# EAGLE design autowater (EAGLE 6.3)
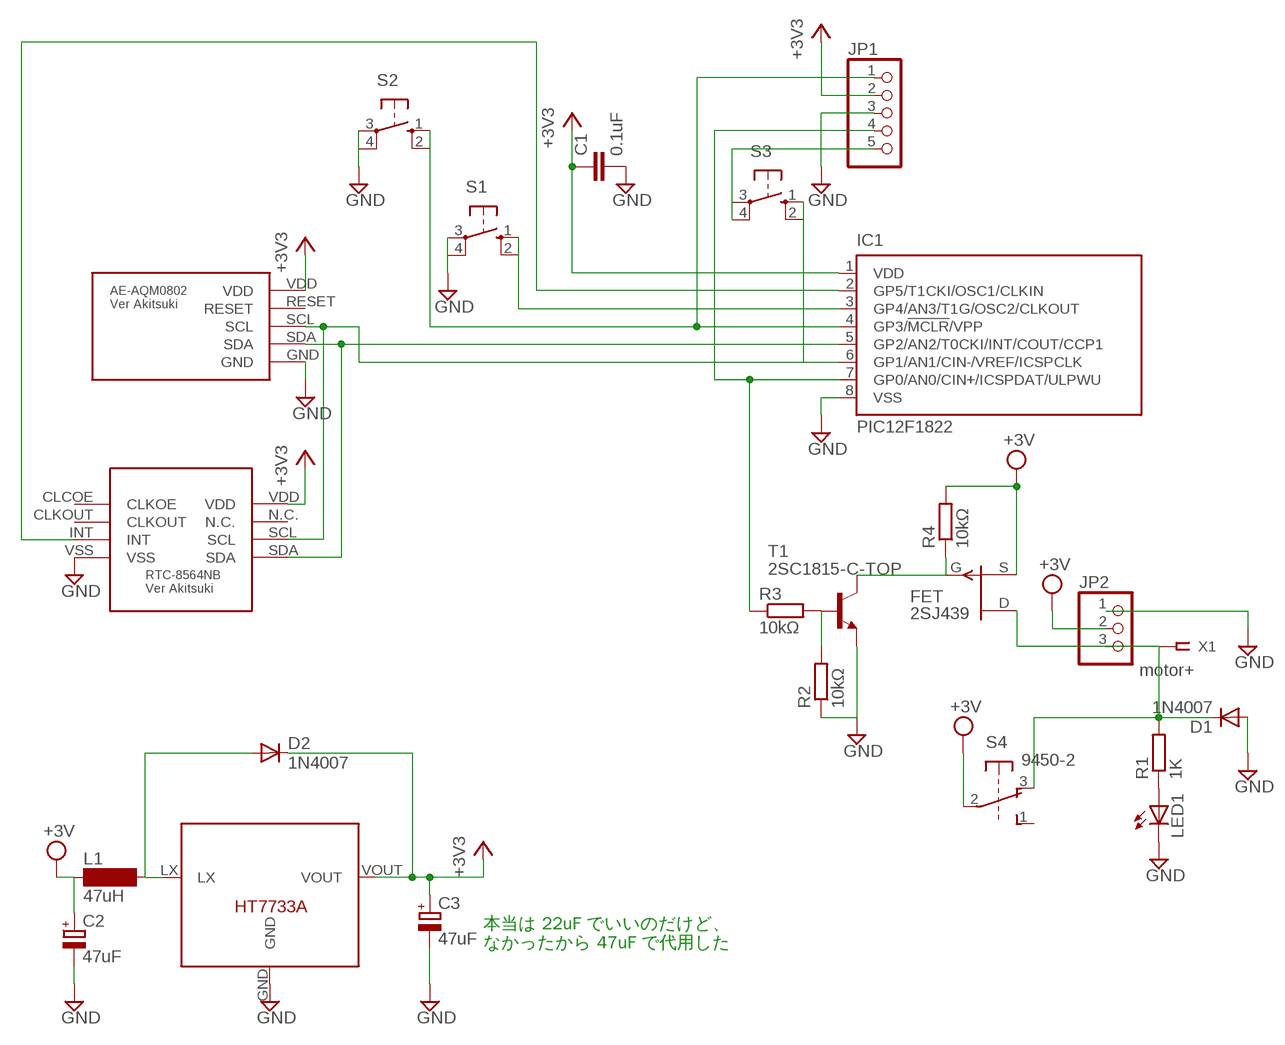
[diagram p0: schematic, sheet 1]

## Parts
C1  0.1uF  C7.5/3  [C7.5B3]
C2  47uF  CPOL-EUTT2D5  [TT2D5]
C3  47uF  CPOL-EUTT2D5  [TT2D5]
D1  1N4007  1N4148DO35-7  [DO35-7]
D2  1N4007  1N4148DO35-7  [DO35-7]
FET  2SJ439  [2SJ439]
IC1  PIC12F1822  PIC12F683P  [DIL8]
JP1  PINHD-1X5  [1X05]
JP2  PINHD-1X3  [1X03]
L1  47uH  SD75  [SD75]
LED1  LEDLZR181  [LZR181]
R1  1K  R-EU_0204/7  [0204/7]
R2  10kΩ  R-EU_0204/7  [0204/7]
R3  10kΩ  R-EU_0207/12  [0207/12]
R4  10kΩ  R-EU_0204/7  [0204/7]
S1  10-XX  [B3F-10XX]
S2  10-XX  [B3F-10XX]
S3  10-XX  [B3F-10XX]
S4  9450-2  [9450-2]
T1  2SC1815-C-TOP  [2SC1815-C-TOP]
U$1  RTC-8564NB-VER-AKITSUKI  [RTC-8564NB-VER-AKITSUKI]
U$2  AE-AQM0802-VER-AKITSUKI  [AE-AQM0802-VER-AKITSUKI]
U$4  HT7733A  [HT7733A]
X1  motor+  SSW-101-02-S-S  [SSW-101-02-S-S]

## Nets
+3V3: C1.1 C3.+ D2.C IC1.1(VDD) JP1.2 U$1.VDD U$2.VDD U$4.VOUT
GND: C1.2 C2.- C3.- D1.A IC1.8(VSS) JP1.3 JP2.1 LED1.K(C) R2.1 S1.3(P) S2.3(P) T1.E U$1.VSS U$2.GND U$4.GND
N$1: IC1.5(GP2/AN2/T0CKI/INT/COUT/CCP1) U$1.SDA U$2.SDA
N$2: IC1.2(GP5/T1CKI/OSC1/CLKIN) U$1.INT
N$3: JP1.5 S3.4(P1)
N$4: IC1.6(GP1/AN1/CIN-/VREF/ICSPCLK) S3.1(S) U$1.SCL U$2.SCL
N$5: IC1.3(GP4/AN3/T1G/OSC2/CLKOUT) S1.1(S)
N$6: IC1.4(GP3/!MCLR!/VPP) JP1.1 S2.1(S)
N$7: LED1.A R1.1
N$8: R2.2 R3.2 T1.B
N$10: D1.C FET.D JP2.3 R1.2 S4.3(1:O) X1.1
N$17: IC1.7(GP0/AN0/CIN+/ICSPDAT/ULPWU) JP1.4 R3.1
N$24: D2.A L1.2 U$4.LX
N$25: FET.G R4.1 T1.C
VCC: C2.+ FET.S JP2.2 L1.1 R4.2 S4.2(1:P) ; supply symbol labelled +3V
Unconnected: S1.2(S1) S1.4(P1) S2.2(S1) S2.4(P1) S3.2(S1) S3.3(P) S4.1(1:S) S4.4(2:S) S4.5(2:P) S4.6(2:O) U$1.CLCOE(CLKOE) U$1.CLKOUT U$1.N.C. U$2.RESET

## Notes on the sheet
- 本当は 22uF でいいのだけど、
  なかったから 47uF で代用した

## Library data of the parts
C1 = capacitor-wima:C: CAPACITOR naming: grid - package width
C2 C3 = rcl:CPOL-EU: POLARIZED CAPACITOR, European symbol
D1 D2 = diode:1N4148: DIODE high speed (Philips)
FET = toshiba-fet:2SJ439
IC1 = microchip:PIC12F683: 8-Pin Flash-Based, 8-Bit CMOS Microcontrollers with nanoWatt Technology Source: http://ww1.microchip.com/downloads/en/DeviceDoc/41211D_.pdf; MF: MICROCHIP; MPN: PIC12F1822; OC_FARNELL: 9759034; OC_NEWARK: 89H0442
JP1 = pinhead:PINHD-1X5: PIN HEADER
JP2 = pinhead:PINHD-1X3: PIN HEADER
L1 = inductor-neosid:SD75: INDUCTOR nominal inductance, E12; OC_FARNELL: unknown; OC_NEWARK: unknown
LED1 = led:LED: LED OSRAM: - CHIPLED LG R971, LG N971, LY N971, LG Q971, LY Q971, LO R971, LY R971 LH N974, LH R974 LS Q976, LO Q976, LY Q976 LO Q996 - Hyper CHIPLED LW Q18S LB Q993, LB Q99A, LB R99A - SideLED LS A670, LO A670, LY A670, LG A670, LP A670 LB A673, LV A673, LT A673, LW A673 LH A674 LY A675 LS A676, LA A676, LO A676, LY A676, LW A676 LS A679, LY A679, LG A679 - Hyper Micro SIDELED® LS Y876, LA Y876, LO Y876, LY Y876 LT Y87S - SmartLED LW L88C, LW L88S LB L89C, LB L89S, LG L890 LS L89K, LO L89K, LY L89K LS L896, LA L896, LO L896, LY L896 - TOPLED LS T670, LO T670, LY T670, LG T670, LP T670 LSG T670, LSP T670, LSY T670, LOP T670, LYG T670 LG T671, LOG T671, LSG T671 LB T673, LV T673, LT T673, LW T673 LH T674 LS T676, LA T676, LO T676, LY T676, LB T676, LH T676, LSB T676, LW T676 LB T67C, LV T67C, LT T67C, LS T67K, LO T67K, LY T67K, LW E67C LS E67B, LA E67B, LO E67B, LY E67B, LB E67C, LV E67C, LT E67C LW T67C LS T679, LY T679, LG T679 LS T770, LO T770, LY T770, LG T770, LP T770 LB T773, LV T773, LT T773, LW T773 LH T774 LS E675, LA E675, LY E675, LS T675 LS T776, LA T776, LO T776, LY T776, LB T776 LHGB T686 LT T68C, LB T68C - Hyper Mini TOPLED® LB M676 - Mini TOPLED Santana® LG M470 LS M47K, LO M47K, LY M47K Source: http://www.osram.convergy.de LUXEON: - LUMILED® LXK2-PW12-R00, LXK2-PW12-S00, LXK2-PW14-U00, LXK2-PW14-V00 LXK2-PM12-R00, LXK2-PM12-S00, LXK2-PM14-U00 LXK2-PE12-Q00, LXK2-PE12-R00, LXK2-PE12-S00, LXK2-PE14-T00, LXK2-PE14-U00 LXK2-PB12-K00, LXK2-PB12-L00, LXK2-PB12-M00, LXK2-PB14-N00, LXK2-PB14-P00, LXK2-PB14-Q00 LXK2-PR12-L00, LXK2-PR12-M00, LXK2-PR14-Q00, LXK2-PR14-R00 LXK2-PD12-Q00, LXK2-PD12-R00, LXK2-PD12-S00 LXK2-PH12-R00, LXK2-PH12-S00 LXK2-PL12-P00, LXK2-PL12-Q00, LXK2-PL12-R00 Source: www.luxeon.com KINGBRIGHT: KA-3528ASYC Source: www.kingbright.com
R1-R4 = resistor:R-EU_: RESISTOR, European symbol
S1-S3 = switch-omron:10-XX: OMRON SWITCH; MPN: B3F-1000; OC_FARNELL: 176432; OC_NEWARK: 36M3542
S4 = switch-misc:9450-2: MARQUARDT SWITCH
T1 = transistor-bend-pin:2SC1815-C-TOP
U$1 = akitsuki-RTC-8564NB:RTC-8564NB-VER-AKITSUKI: RTC-8564NB ver Akitsuki
U$2 = akitsuki-AE-AQM0802:AE-AQM0802-VER-AKITSUKI
U$4 = dcdcconverter-HT77XX:HT7733A
X1 = con-samtec:SSW-101-02-S-S: THROUGH-HOLE .025" SQ POST SOCKET Source: Samtec SSW.pdf; MPN: SSW-101-02-S-S; OC_FARNELL: unknown; OC_NEWARK: 11P9336

## Board
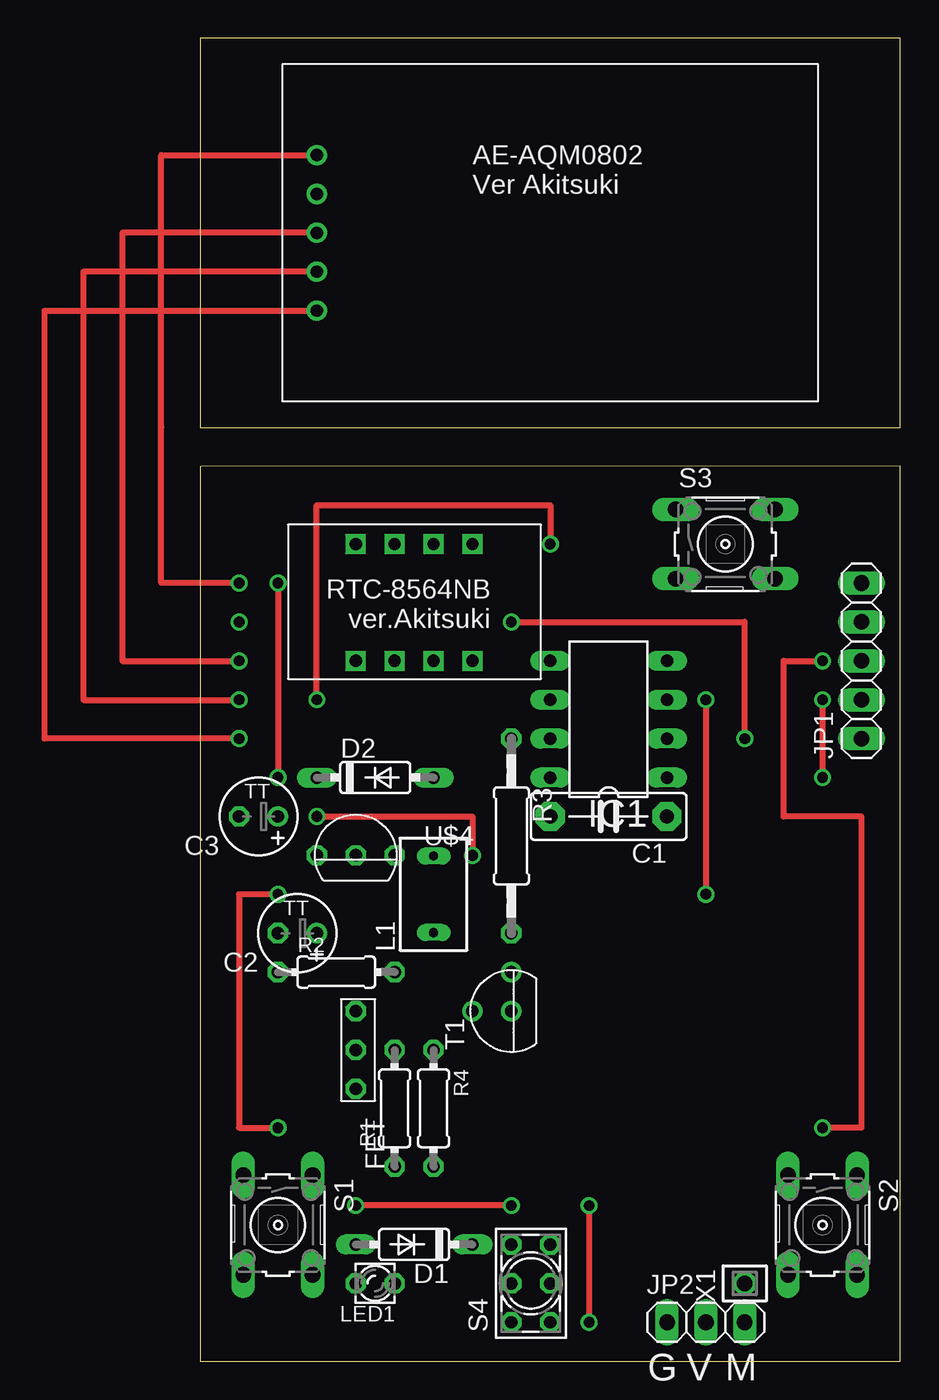
[diagram p1: board, top side]
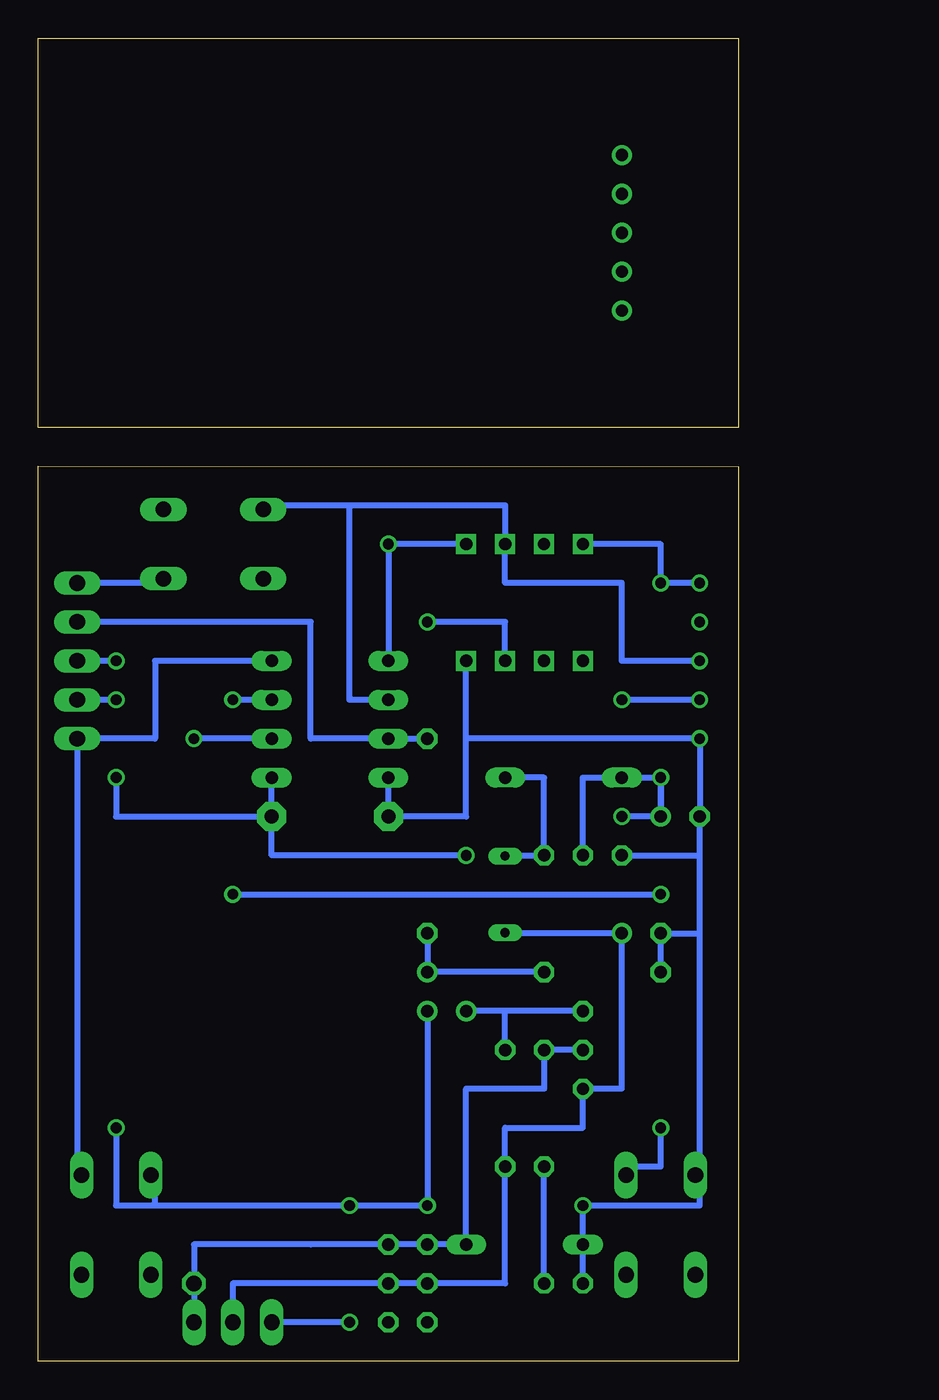
[diagram p2: board, bottom side, seen from below]

Size 45.72 x 86.36 mm. Coordinates in mm from the lower left corner, seen from the top.
Outline: 0,60.95 45.72,60.96 45.72,86.36 0,86.36 0,60.96
Outline: 0,0 45.72,0 45.72,58.42 0,58.41 0,0
Copper layers (1*16): Top 0.035mm / dielectric 1.5mm / Bottom 0.035mm
Design rules "default": minimum track width 10mil, minimum drill 24mil, track to track 8mil, track to pad 8mil, pad to pad 8mil, via to via 8mil, smd to smd 8mil, copper to edge 40mil, drill to drill 8mil, minimum pad ring 10mil, minimum via ring 8mil, stop-mask expansion 4mil, vias tented up to drill 0mil, thermal gap 10mil
vRestrict: area 0,53.3 to 5.1,58.4; area 40.6,53.3 to 45.7,58.4; area 40.6,0 to 45.7,5.1; area 0,0 to 5.1,5.1

### Footprints (pad centres in the part's own frame; a part is rotated, then mirrored left to right if it is on the bottom)
C7.5B3 = drill 0.914 pad 1.905 octagon: 1 -3.81,0; 2 3.81,0
TT2D5 = drill 0.813: + -1.27,0 | drill 0.813 octagon: - 1.27,0
DO35-7 = drill 0.813 long: A 3.81,0; C -3.81,0
2SJ439 = drill 0.813 octagon: D 0,0; G -2.54,0; S 2.54,0
DIL8 = drill 0.813 long: 1 -3.81,-3.81; 2 -1.27,-3.81; 3 1.27,-3.81; 4 3.81,-3.81; 5 3.81,3.81; 6 1.27,3.81; 7 -1.27,3.81; 8 -3.81,3.81
1X05 = drill 1.016 long: 1 -5.08,0; 2 -2.54,0; 3 0,0; 4 2.54,0; 5 5.08,0
1X03 = drill 1.016 long: 1 -2.54,0; 2 0,0; 3 2.54,0
SD75 = drill 0.6 long: 1 -2.5,0; 2 2.5,0
LZR181 = drill 0.813 octagon: A -1.27,0; K 1.27,0
0204/7 = drill 0.813 octagon: 1 -3.81,0; 2 3.81,0
0207/12 = drill 0.813 octagon: 1 -6.35,0; 2 6.35,0
B3F-10XX = drill 1.016 long: 1 -3.251,2.261; 2 3.251,2.261; 3 -3.251,-2.261; 4 3.251,-2.261
9450-2 = drill 0.813 octagon: 1 -2.54,-1.27; 2 0,-1.27; 3 2.54,-1.27; 4 -2.54,1.27; 5 0,1.27; 6 2.54,1.27
2SC1815-C-TOP = drill 0.813: B 2.54,0; C 0,2.54; E 0,0
RTC-8564NB-VER-AKITSUKI = drill 0.8 square: CLCOE -3.81,3.81; CLKOUT -3.81,1.27; INT -3.81,-1.27; N.C. 3.81,1.27; SCL 3.81,-1.27; SDA 3.81,-3.81; VDD 3.81,3.81; VSS -3.81,-3.81
AE-AQM0802-VER-AKITSUKI = drill 0.8: GND -15.24,-5.08; RESET -15.24,2.54; SCL -15.24,0; SDA -15.24,-2.54; VDD -15.24,5.08
HT7733A = drill 0.813 octagon: GND -2.54,0; LX 2.54,0; VOUT 0,0
SSW-101-02-S-S = drill 1 pad 1.5 octagon: 1 0,0

### Placement (x,y rotation side)
C1  26.67,35.56 180 top
C2  6.35,27.94 180 top
C3  3.81,35.56 180 top
D1  13.97,7.62 180 top
D2  11.43,38.1 0 top
FET  10.16,20.32 270 top
IC1  26.67,41.91 90 top
JP1  43.18,45.72 90 top
JP2  33.02,2.54 0 top
L1  15.24,30.48 90 top
LED1  11.43,5.08 180 top
R1  12.7,16.51 90 top
R2  8.89,25.4 0 top
R3  20.32,34.29 270 top
R4  15.24,16.51 270 top
S1  5.08,8.89 270 top
S2  40.64,8.89 270 top
S3  34.29,53.34 0 top
S4  21.59,5.08 90 top
T1  20.32,22.86 90 top
U$1  13.97,49.53 90 top
U$2  22.86,73.66 0 top
U$4  10.16,33.02 0 top
X1  35.56,5.08 0 top

### Tracks (layer width: path | path; a pad name or v marks a point on that pad's centre or on a via)
+3V3  (via drill 0.7)
  Top 0.406: v2.54,50.8 -2.54,50.8 -2.54,60.96 -2.54,78.74 U$2.VDD | v40.64,43.18 v40.64,38.1 | v5.08,50.8 v5.08,38.1 | v7.62,35.56 17.78,35.56 v17.78,33.02
  Bottom 0.406: C1.1 IC1.1 | v2.54,50.8 v5.08,50.8 5.08,53.34 U$1.VDD | v40.64,43.18 JP1.2 | v40.64,38.1 40.64,35.56 C1.1 | C3.+ v5.08,38.1 | v5.08,38.1 C3.+ | C1.1 30.48,33.02 v17.78,33.02 | U$4.VOUT 10.16,38.1 D2.C v5.08,38.1 | C3.+ v7.62,35.56
GND  (via drill 0.7)
  Top 0.406: v2.54,40.64 -10.16,40.64 -10.16,68.58 U$2.GND | v40.64,15.24 43.18,15.24 43.18,35.56 38.1,35.56 38.1,45.72 v40.64,45.72 | v25.4,10.16 v25.4,2.54 | v20.32,10.16 v10.16,10.16
  Bottom 0.406: IC1.8 C1.2 17.78,35.56 17.78,40.64 | 17.78,40.64 U$1.VSS | v40.64,15.24 40.64,10.16 38.1,10.16 | 17.78,40.64 v2.54,40.64 C3.- 2.54,33.02 | 2.54,12.7 2.54,20.32 2.54,27.94 | v40.64,45.72 JP1.3 | U$4.GND 2.54,33.02 | 2.54,27.94 2.54,33.02 | 2.54,27.94 C2.- R2.1 | 2.54,12.7 2.54,10.16 v10.16,10.16 D1.A LED1.K | 2.54,12.7 2.82,12.42 S1.3 | 38.1,10.16 38.1,12.7 38.38,12.42 S2.3 | 38.1,10.16 v25.4,10.16 v20.32,10.16 T1.E | v25.4,2.54 JP2.1
N$1  (via drill 0.7)
  Top 0.406: v7.62,43.18 7.62,55.88 22.86,55.88 v22.86,53.34 | U$2.SDA -7.62,71.12 -7.62,43.18 v2.54,43.18
  Bottom 0.406: v2.54,43.18 v7.62,43.18 | IC1.5 v22.86,53.34 U$1.SDA
N$2  (via drill 0.7)
  Top 0.406: v35.56,40.64 35.56,48.26 v20.32,48.26
  Bottom 0.406: IC1.2 v35.56,40.64 | U$1.INT 15.24,48.26 v20.32,48.26
N$3
  Bottom 0.406: S3.4 37.82,51.08 38.1,50.8 JP1.5
N$4  (via drill 0.7)
  Top 0.406: U$2.SCL -5.08,73.66 -5.08,45.72 v2.54,45.72
  Bottom 0.406: v2.54,45.72 7.62,45.72 7.62,50.8 15.24,50.8 U$1.SCL 15.24,55.88 25.4,55.88 | S3.1 30.76,55.6 30.48,55.88 25.4,55.88 | IC1.6 25.4,43.18 25.4,55.88
N$5  (via drill 0.7)
  Top 0.406: v33.02,43.18 v33.02,30.48 | v5.08,30.48 2.54,30.48 2.54,15.24 v5.08,15.24
  Bottom 0.406: IC1.3 v33.02,43.18 | v33.02,30.48 v5.08,30.48 | v5.08,15.24 5.08,12.7 7.62,12.7 7.34,12.7 S1.1
N$6
  Bottom 0.406: S2.1 42.9,12.7 43.18,12.7 JP1.1 38.1,40.64 38.1,45.72 IC1.4
N$7
  Bottom 0.406: LED1.A R1.1
N$8
  Bottom 0.406: R3.2 T1.B R2.2
N$10
  Bottom 0.406: JP2.3 X1.1 35.56,7.62 27.94,7.62 S4.3 D1.C 17.78,17.78 12.7,17.78 R1.2 FET.D
N$17
  Bottom 0.406: JP1.4 40.64,48.26 27.94,48.26 27.94,40.64 IC1.7 R3.1
N$19  (via drill 0.7)
  other vias: 2.54,48.26
N$24
  Bottom 0.406: D2.A 12.7,38.1 U$4.LX 12.74,32.98 L1.2
N$25
  Bottom 0.406: FET.G 15.24,22.86 | 15.24,22.86 T1.C | R4.1 15.24,22.86
VCC
  Bottom 0.406: JP2.2 33.02,5.08 S4.2 15.24,5.08 R4.2 15.24,15.24 10.16,15.24 FET.S 7.62,17.78 C2.+ 15.24,27.94 L1.1

### Text on the board
tNames: G | V | M